# EAGLE design MKRSDProtoshield_Rev1.1 (EAGLE 9.1.3)
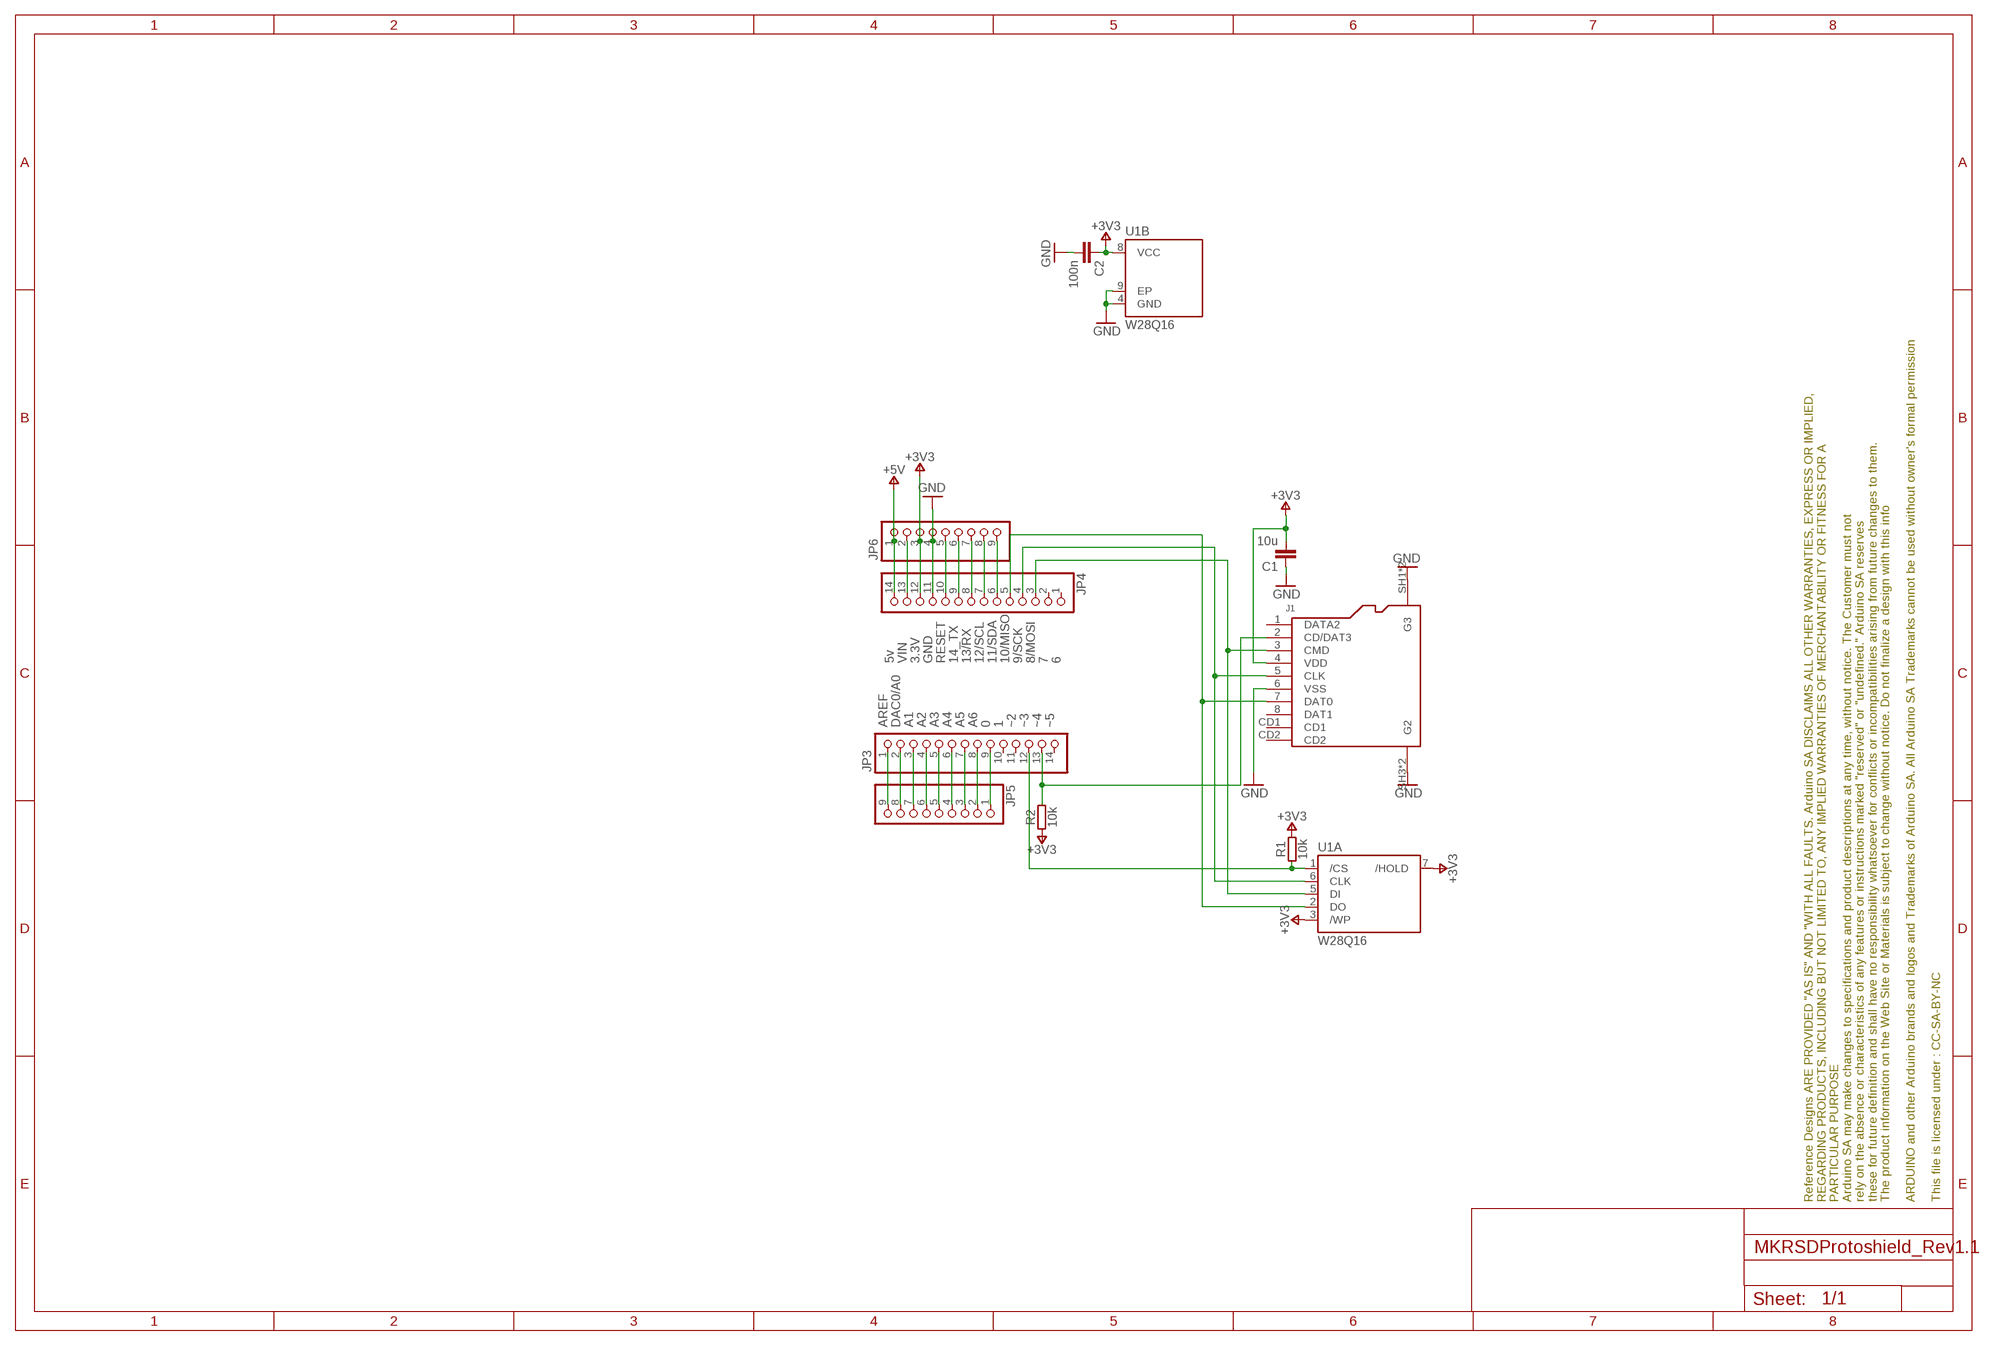
[diagram p0: schematic, sheet 1]

## Parts
C1  10u  C-10UF-0603  [0603-1608X90N]
C2  100n  C-100NF-0603  [0603-1608X90N]
FRAME1  DNP  A3-FRAME-STANDARD  [FRAME]
J1  AMPHENOL_114-00841-68  [AMPHENOL_114-00841-68]
JP3  -  PINHD-1X14TH  [1X14]
JP4  -  PINHD-1X14TH  [1X14]
JP5  PINHD-1X9  [1X09]
JP6  PINHD-1X9  [1X09]
R1  10k  R-10K-0603  [C0603]
R2  10k  R-10K-0603  [C0603]
U1  W28Q16  W25Q16DVZPIG  [SON9P127_500X600X80L60X41T340X400N]

## Nets
+3V3: C1.2 C2.1 J1.4(VDD) JP4.12 JP6.3 R1.2 R2.1 U1.3(A:/WP) U1.7(A:/HOLD) U1.8(B:VCC)
+5V: JP4.14 JP6.1
GND: C1.1 C2.2 J1.6(VSS) J1.SH1(G3) J1.SH2(G3) J1.SH3(G2) J1.SH4(G2) JP4.11 JP6.4 U1.4(B:GND) U1.9(B:EP)
N$2: J1.2(CD/DAT3) JP3.13 R2.2
N$3: J1.3(CMD) JP4.3 U1.5(A:DI)
N$4: J1.5(CLK) JP4.4 U1.6(A:CLK)
N$5: J1.7(DAT0) JP4.5 U1.2(A:DO)
N$23: JP3.7 JP5.3
N$24: JP3.6 JP5.4
N$25: JP3.5 JP5.5
N$26: JP3.4 JP5.6
N$27: JP3.3 JP5.7
N$28: JP3.2 JP5.8
N$29: JP3.1 JP5.9
N$30: JP4.13 JP6.2
N$31: JP4.10 JP6.5
N$32: JP4.9 JP6.6
N$33: JP4.8 JP6.7
N$107: JP4.7 JP6.8
N$108: JP4.6 JP6.9
N$109: JP3.8 JP5.2
N$110: JP3.9 JP5.1
N$119: JP3.12 R1.1 U1.1(A:/CS)
Unconnected: J1.1(DATA2) J1.8(DAT1) J1.CD1 J1.CD2 JP3.10 JP3.11 JP3.14 JP4.1 JP4.2

## Notes on the sheet
- 5v | VIN | 3.3V | GND | RESET | 14_TX | 13/RX | 12/SCL | 11/SDA | 10/MISO | 9/SCK | 8/MOSI | 7 | 6
- AREF | DAC0/A0 | A1 | A2 | A3 | A4 | A5 | A6 | 0 | 1 | ~2 | ~3 | ~4 | ~5

## Library data of the parts
C1 = Arduino-rcl:C: SMD Capacitor; CODE-BCE: -; CODE-BCMI: -; CODE-TK2: -; DATASHEET: http://www.murata.com/~/media/webrenewal/support/library/catalog/products/capacitor/mlcc/c02e.pdf; DISTRIBUTOR-LINK: http://www.digikey.com/product-search/en?keywords=490-10728-1-ND; DISTRIBUTOR-PN: 490-10728-1-ND; MANUFACTURER: Murata; MANUFACTURER-PN: GRM188R61C106KAALD
C2 = Arduino-rcl:C: SMD Capacitor; CODE-BCE: SP0015; CODE-BCMI: 0015; CODE-TK2: CL10B104KB8NNNC; DATASHEET: http://search.murata.co.jp/Ceramy/image/img/A01X/G101/ENG/GRM188R71C104KA01-01.pdf; DISTRIBUTOR-LINK: https://www.digikey.com/product-detail/en/murata-electronics-north-america/GRM188R71C104KA01D/490-1532-1-ND/587771; DISTRIBUTOR-PN: 490-1532-2-ND; MANUFACTURER: Murata; MANUFACTURER-PN: GRM188R71C104KA01D
FRAME1 = Arduino-utility:A3-FRAME: Schematic frame; CODE-ARDUINO: DNP; DATASHEET: DNP; DISTRIBUTOR-LINK: DNP; DISTRIBUTOR-PN: DNP; MANUFACTURER: DNP; MANUFACTURER-PN: DNP
J1 = Arduino-connectors:AMPHENOL_114-00841-68
JP3 JP4 = Arduino-connectors:PINHD-1X14: PIN HEADER; CODE-BCE: -; CODE-TK2: -; DATASHEET: -; DISTRIBUTOR-LINK: -; DISTRIBUTOR-PN: -; MANUFACTURER: ELDECO; MANUFACTURER-PN: FH254114DF08500T
JP5 JP6 = pinhead:PINHD-1X9: PIN HEADER
R1 R2 = Arduino-rcl:R: SMD Resistor; CODE-BCE: SP0899; CODE-BCMI: 0899; CODE-TK2: -; DATASHEET: http://www.yageo.com/documents/recent/PYu-RC_Group_51_RoHS_L_8.pdf; DISTRIBUTOR-LINK: https://www.digikey.com/product-detail/en/yageo/RC0603JR-0710KL/311-10KGRCT-ND/729647; DISTRIBUTOR-PN: 311-10KGRCT-ND; MANUFACTURER: Yageo; MANUFACTURER-PN: RC0603JR-0710KL
U1 = Arduino-ICs:W25Q*: Flash; CODE-BCE: -; CODE-TK2: -; DATASHEET: https://www.winbond.com/resource-files/da00-w25q16dv_f2.pdf; DISTRIBUTOR-LINK: http://www.digikey.com/products/en?keywords=W25Q16DVZPIG-ND; DISTRIBUTOR-PN: W25Q16DVZPIG-ND; MANUFACTURER: Winbond; MANUFACTURER-PN: W25Q16DVZPIG

## Board
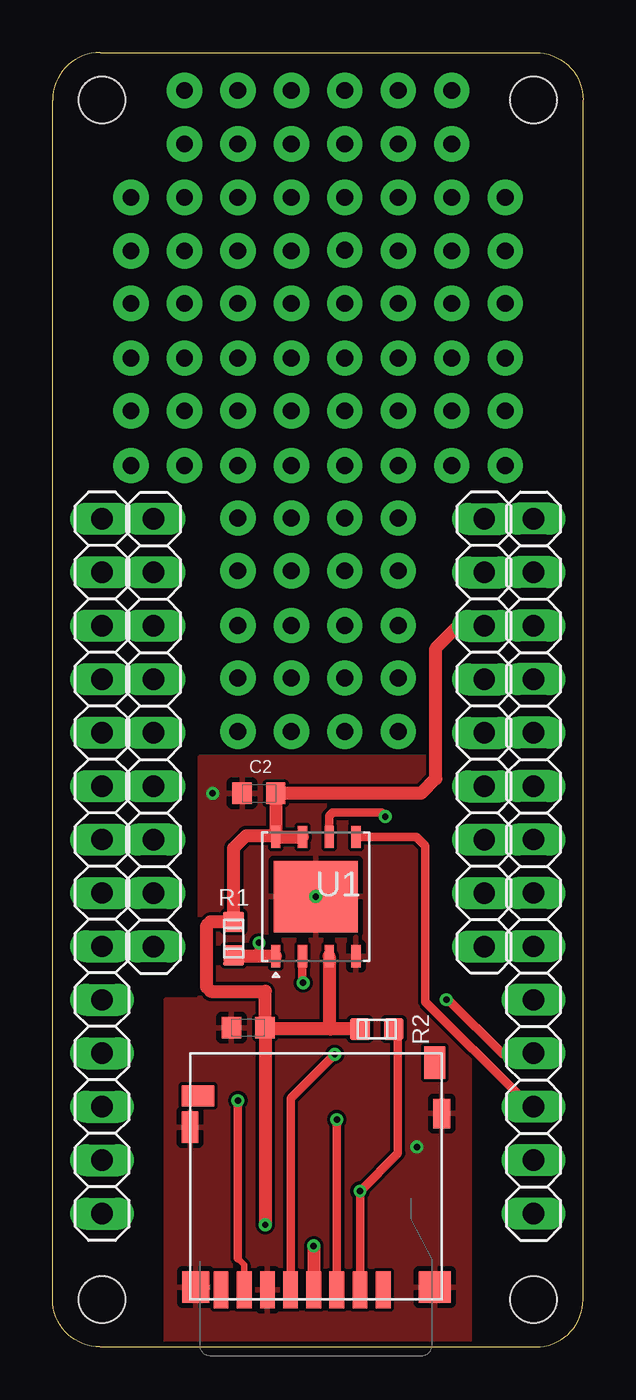
[diagram p1: board, top side]
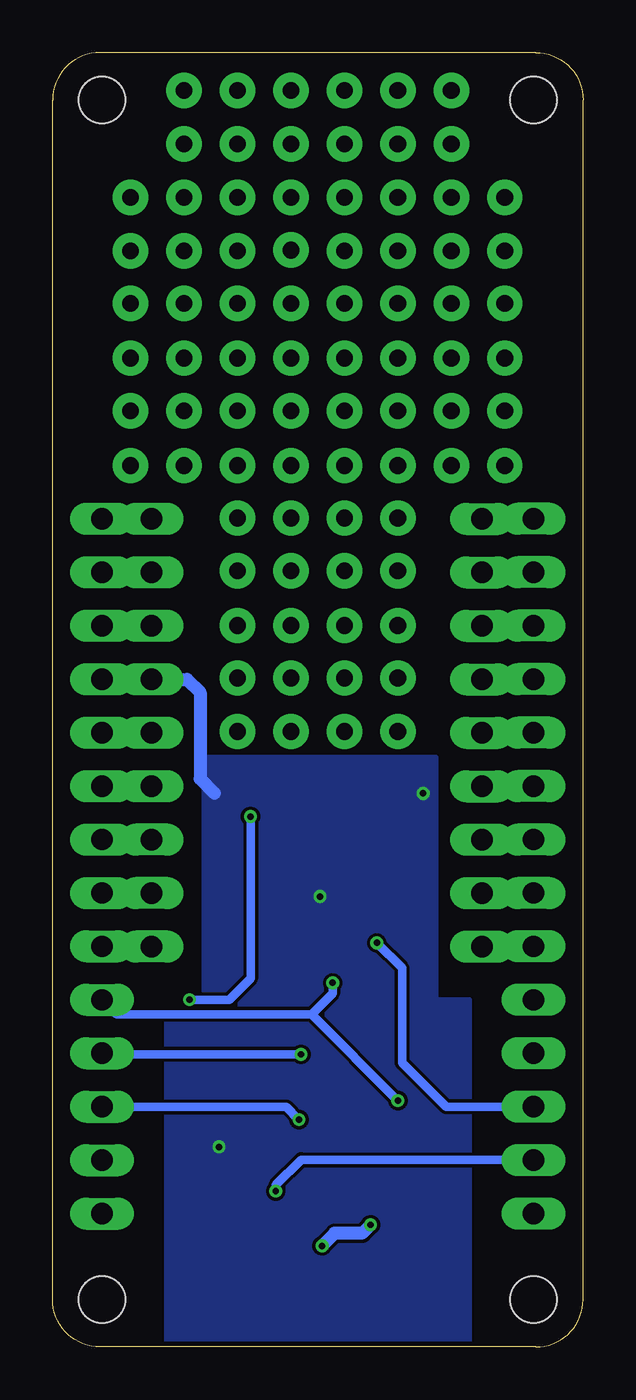
[diagram p2: board, bottom side, seen from below]

Size 25.2 x 61.5 mm. Coordinates in mm from the lower left corner, seen from the top.
Outline: 25.2,2.25 25.2,59.25 arc90 22.95,61.5 2.25,61.5 arc90 0,59.25 0,2.25 arc90 2.25,0 22.95,0 arc90 25.2,2.25
Copper layers (1*16): Top 0.035mm / dielectric 1.5mm / Bottom 0.035mm
Design rules "SeeedStudio_2layers": minimum track width 6mil, minimum drill 12mil, track to track 6mil, track to pad 6mil, pad to pad 6mil, via to via 6mil, smd to smd 0mil, copper to edge 10mil, drill to drill 10mil, minimum pad ring 10mil, minimum via ring 6mil, stop-mask expansion 2mil, vias tented up to drill 100mil, thermal gap 10mil
Holes 2.2 mm at 2.35,2.25 22.85,2.25 2.35,59.25 22.85,59.25

### Footprints (pad centres in the part's own frame; a part is rotated, then mirrored left to right if it is on the bottom)
0603-1608X90N = smd 0.95 x 1: 1 -0.8,0; 2 0.8,0
AMPHENOL_114-00841-68 = smd 0.7 x 1.75: 1 3.2,-5.888; 2 2.1,-5.888; 3 1,-5.888; 4 -0.1,-5.888; 5 -1.2,-5.888; 6 -2.3,-5.888; 7 -3.4,-5.888; 8 -4.5,-5.888 | smd 1 x 1.55: CD1 5.65,4.912 | smd 1.55 x 1: CD2 -5.602,3.337 | smd 1.3 x 1.5: SH1 -5.7,-5.76 | smd 1.5 x 1.5: SH2 5.65,-5.76 | smd 0.8 x 1.4: SH3 5.975,2.487 | smd 0.8 x 1.5: SH4 -5.975,1.837
1X14 = drill 1.016 long: 1 -16.51,0; 2 -13.97,0; 3 -11.43,0; 4 -8.89,0; 5 -6.35,0; 6 -3.81,0; 7 -1.27,0; 8 1.27,0; 9 3.81,0; 10 6.35,0; 11 8.89,0; 12 11.43,0; 13 13.97,0; 14 16.51,0
1X09 = drill 1.016 long: 1 -10.16,0; 2 -7.62,0; 3 -5.08,0; 4 -2.54,0; 5 0,0; 6 2.54,0; 7 5.08,0; 8 7.62,0; 9 10.16,0
C0603 = smd 1 x 0.95: 1 0,0.8; 2 0,-0.8
SON9P127_500X600X80L60X41T340X400N = smd 0.44 x 1.06: 1 -1.905,-2.835; 2 -0.635,-2.835; 3 0.635,-2.835; 4 1.905,-2.835; 5 1.905,2.835; 6 0.635,2.835; 7 -0.635,2.835; 8 -1.905,2.835 | smd 4 x 3.4: 9 0,0

### Placement (x,y rotation side)
C1  9.29,15.17 0 top
C2  9.8,26.3 180 top
FRAME1  -0.8,-3.6 0 top  (outside the outline)
J1  12.5,8.6 0 top
JP3  2.35,22.84 270 top
JP4  22.85,22.84 90 top
JP5  4.8,29.18 90 top
JP6  20.5,29.18 270 top
R1  8.6,19.4 180 top
R2  15.4,15.1 90 top
U1  12.5,21.4 0 top

### Tracks (layer width: path | path; a pad name or v marks a point on that pad's centre or on a via)
+3V3  (via drill 0.3)
  Top 0.61: v10.1,5.8 C1.2 | v12.4,4.8 J1.4 | U1.8 C2.1 17.5,26.3 18.2,27 18.2,33.2 19.3,34.3 20.46,34.3 JP6.3 JP4.12 | U1.8 10.53,24.3 9.2,24.3 8.6,23.7 R1.2 7.5,20.2 7.3,20 7.3,17.1 7.5,16.9 10.1,16.9 10.09,16.89 C1.2 | U1.8 U1.7 | 13.2,15.1 10.16,15.1 C1.2 | U1.3 13.13,15.16 13.2,15.1 | R2.1 13.2,15.1
  Bottom 0.61: v10.1,5.8 10.5,5.4 11.8,5.4 v12.4,4.8
+5V
  Bottom 1.016: JP6.1 JP4.14
GND  (via drill 0.3)
  Bottom 0.61: JP6.4 18.82,31.72 18.2,31.1 18.2,27 17.5,26.3
  Bottom 1.016: JP4.11 JP6.4
  other vias: 17.3,9.5 12.5,21.4 7.6,26.3
  pour Top: 5.4,16.5 7,16.5 7,28 18,28 18,16.5 19.79,16.5 19.79,-0.3 5.4,-0.3
  pour Bottom: 5.4,16.5 7,16.5 7,28 18,28 18,16.5 19.79,16.5 19.79,-0.3 5.4,-0.3
N$1  (via drill 0.8 pad 1.68)
  other vias: 11.34,39.38
N$2  (via drill 0.3)
  Top 0.406: J1.2 v14.6,7.4 16.4,9.2 16.4,14.9 R2.2
  Bottom 0.406: v14.6,7.4 14.6,7.7 13.4,8.9 2.38,8.9 JP3.13
N$3  (via drill 0.3)
  Top 0.406: v13.5,10.8 J1.3 | U1.5 17.27,24.23 17.7,23.8 17.7,16.4 22.2,11.9 22.36,11.9 JP4.3
  Bottom 0.406: JP4.3 14.1,11.4 v13.5,10.8
N$4  (via drill 0.3)
  Top 0.406: J1.5 11.3,11.8 v13.4,13.9 | U1.6 13.13,25.23 13.3,25.4 15.6,25.4 v15.8,25.2 | v18.7,16.5 18.8,16.5 21.4,13.9 22.8,13.9 JP4.4
  Bottom 0.406: v13.4,13.9 22.8,13.9 JP4.4 | v15.8,25.2 15.8,17.5 16.8,16.5 v18.7,16.5
N$5  (via drill 0.3)
  Top 0.305: 8.8,4.2 9.1,3.9 J1.7
  Top 0.406: v8.8,11.7 8.8,4.2 | U1.2 11.87,17.34 v11.9,17.3
  Bottom 0.406: v8.8,11.7 12.9,15.8 | 12.9,15.8 22.16,15.8 JP4.5 | v11.9,17.3 11.9,16.8 12.9,15.8
N$6  (via drill 0.8 pad 1.68)
  other vias: 16.42,36.88
N$7  (via drill 0.8 pad 1.68)
  other vias: 11.34,34.28
N$8  (via drill 0.8 pad 1.68)
  other vias: 16.42,31.78
N$9  (via drill 0.8 pad 1.68)
  other vias: 11.34,29.24
N$10  (via drill 0.8 pad 1.68)
  other vias: 8.8,29.24
N$11  (via drill 0.8 pad 1.68)
  other vias: 13.88,29.24
N$12  (via drill 0.8 pad 1.68)
  other vias: 16.42,29.24
N$14  (via drill 0.8 pad 1.68)
  other vias: 16.42,52.08
N$15  (via drill 0.8 pad 1.68)
  other vias: 11.34,49.58
N$16  (via drill 0.8 pad 1.68)
  other vias: 16.42,46.98
N$17  (via drill 0.8 pad 1.68)
  other vias: 11.34,44.48
N$18  (via drill 0.8 pad 1.68)
  other vias: 16.42,41.88
N$19  (via drill 0.8 pad 1.68)
  other vias: 6.26,52.08
N$20  (via drill 0.8 pad 1.68)
  other vias: 6.26,49.58
N$21  (via drill 0.8 pad 1.68)
  other vias: 6.26,46.98
N$22  (via drill 0.8 pad 1.68)
  other vias: 6.26,44.48
N$23
  Bottom 1.016: JP3.7 5.8,24.11 JP5.3
N$24
  Bottom 1.016: JP5.4 JP3.6
N$25
  Bottom 1.016: JP3.5 5.8,29.19 JP5.5
N$26
  Bottom 1.016: JP5.6 JP3.4
N$27
  Bottom 1.016: JP5.7 JP3.3
N$28
  Bottom 1.016: JP5.8 JP3.2
N$29
  Bottom 1.016: JP3.1 5.8,39.35 JP5.9
N$30
  Bottom 1.016: JP4.13 19.5,36.81 JP6.2
N$31
  Bottom 1.016: JP4.10 19.5,29.19 JP6.5
N$32
  Bottom 1.016: JP4.9 19.5,26.65 JP6.6
N$33
  Bottom 1.016: JP6.7 JP4.8
N$34  (via drill 0.8 pad 1.68)
  other vias: 6.26,41.88
N$35  (via drill 0.8 pad 1.68)
  other vias: 3.72,52.08
N$36  (via drill 0.8 pad 1.68)
  other vias: 3.72,49.58
N$37  (via drill 0.8 pad 1.68)
  other vias: 3.72,46.98
N$38  (via drill 0.8 pad 1.68)
  other vias: 3.72,44.48
N$39  (via drill 0.8 pad 1.68)
  other vias: 3.72,41.88
N$40  (via drill 0.8 pad 1.68)
  other vias: 18.96,52.08
N$41  (via drill 0.8 pad 1.68)
  other vias: 18.96,49.58
N$42  (via drill 0.8 pad 1.68)
  other vias: 18.96,46.98
N$43  (via drill 0.8 pad 1.68)
  other vias: 18.96,44.48
N$44  (via drill 0.8 pad 1.68)
  other vias: 18.96,41.88
N$45  (via drill 0.8 pad 1.68)
  other vias: 21.5,52.08
N$46  (via drill 0.8 pad 1.68)
  other vias: 21.5,49.58
N$47  (via drill 0.8 pad 1.68)
  other vias: 21.5,46.98
N$48  (via drill 0.8 pad 1.68)
  other vias: 21.5,44.48
N$49  (via drill 0.8 pad 1.68)
  other vias: 21.5,41.88
N$51  (via drill 0.8 pad 1.68)
  other vias: 6.26,54.62
N$52  (via drill 0.8 pad 1.68)
  other vias: 3.72,54.62
N$53  (via drill 0.8 pad 1.68)
  other vias: 18.96,54.62
N$54  (via drill 0.8 pad 1.68)
  other vias: 21.5,54.62
N$55  (via drill 0.8 pad 1.68)
  other vias: 11.34,54.62
N$56  (via drill 0.8 pad 1.68)
  other vias: 16.42,59.7
N$57  (via drill 0.8 pad 1.68)
  other vias: 13.88,49.58
N$58  (via drill 0.8 pad 1.68)
  other vias: 18.96,59.7
N$59  (via drill 0.8 pad 1.68)
  other vias: 13.88,54.62
N$72  (via drill 0.8 pad 1.68)
  other vias: 8.8,31.78
N$73  (via drill 0.8 pad 1.68)
  other vias: 11.34,31.78
N$74  (via drill 0.8 pad 1.68)
  other vias: 13.88,31.78
N$75  (via drill 0.8 pad 1.68)
  other vias: 16.42,34.28
N$76  (via drill 0.8 pad 1.68)
  other vias: 13.88,34.28
N$77  (via drill 0.8 pad 1.68)
  other vias: 8.8,34.28
N$78  (via drill 0.8 pad 1.68)
  other vias: 8.8,36.88
N$79  (via drill 0.8 pad 1.68)
  other vias: 11.34,36.88
N$80  (via drill 0.8 pad 1.68)
  other vias: 13.88,36.88
N$81  (via drill 0.8 pad 1.68)
  other vias: 16.42,39.38
N$82  (via drill 0.8 pad 1.68)
  other vias: 13.88,39.38
N$83  (via drill 0.8 pad 1.68)
  other vias: 8.8,39.38
N$84  (via drill 0.8 pad 1.68)
  other vias: 8.8,41.88
N$85  (via drill 0.8 pad 1.68)
  other vias: 11.34,41.88
N$86  (via drill 0.8 pad 1.68)
  other vias: 13.88,41.88
N$87  (via drill 0.8 pad 1.68)
  other vias: 16.42,44.48
N$88  (via drill 0.8 pad 1.68)
  other vias: 13.88,44.48
N$89  (via drill 0.8 pad 1.68)
  other vias: 8.8,44.48
N$90  (via drill 0.8 pad 1.68)
  other vias: 8.8,46.98
N$91  (via drill 0.8 pad 1.68)
  other vias: 11.34,46.98
N$92  (via drill 0.8 pad 1.68)
  other vias: 13.88,46.98
N$93  (via drill 0.8 pad 1.68)
  other vias: 16.42,49.58
N$94  (via drill 0.8 pad 1.68)
  other vias: 13.88,52.12
N$95  (via drill 0.8 pad 1.68)
  other vias: 8.8,49.58
N$96  (via drill 0.8 pad 1.68)
  other vias: 8.8,52.08
N$97  (via drill 0.8 pad 1.68)
  other vias: 11.34,52.08
N$99  (via drill 0.8 pad 1.68)
  other vias: 16.42,54.62
N$100  (via drill 0.8 pad 1.68)
  other vias: 8.8,57.16
N$101  (via drill 0.8 pad 1.68)
  other vias: 13.88,57.16
N$102  (via drill 0.8 pad 1.68)
  other vias: 11.34,57.16
N$103  (via drill 0.8 pad 1.68)
  other vias: 8.8,54.62
N$104  (via drill 0.8 pad 1.68)
  other vias: 6.26,57.16
N$107
  Bottom 1.016: JP4.7 19.5,21.57 JP6.8
N$108
  Bottom 1.016: JP4.6 19.5,19.03 JP6.9
N$109
  Bottom 1.016: JP5.2 JP3.8
N$110
  Bottom 1.016: JP3.9 5.8,19.03 JP5.1
N$112  (via drill 0.8 pad 1.68)
  other vias: 6.26,59.7
N$113  (via drill 0.8 pad 1.68)
  other vias: 8.8,59.7
N$114  (via drill 0.8 pad 1.68)
  other vias: 11.34,59.7
N$115  (via drill 0.8 pad 1.68)
  other vias: 13.88,59.7
N$116  (via drill 0.8 pad 1.68)
  other vias: 16.42,57.16
N$117  (via drill 0.8 pad 1.68)
  other vias: 18.96,57.16
N$119  (via drill 0.3)
  Top 0.406: v9.8,19.2 9.8,18.57
  Top 0.61: U1.1 9.8,18.57 8.63,18.57 R1.1
  Bottom 0.406: JP3.12 6.51,11.41 8.6,13.5 8.6,18 v9.8,19.2